# EAGLE schematic sensor_v60 (EAGLE 7.7.0)
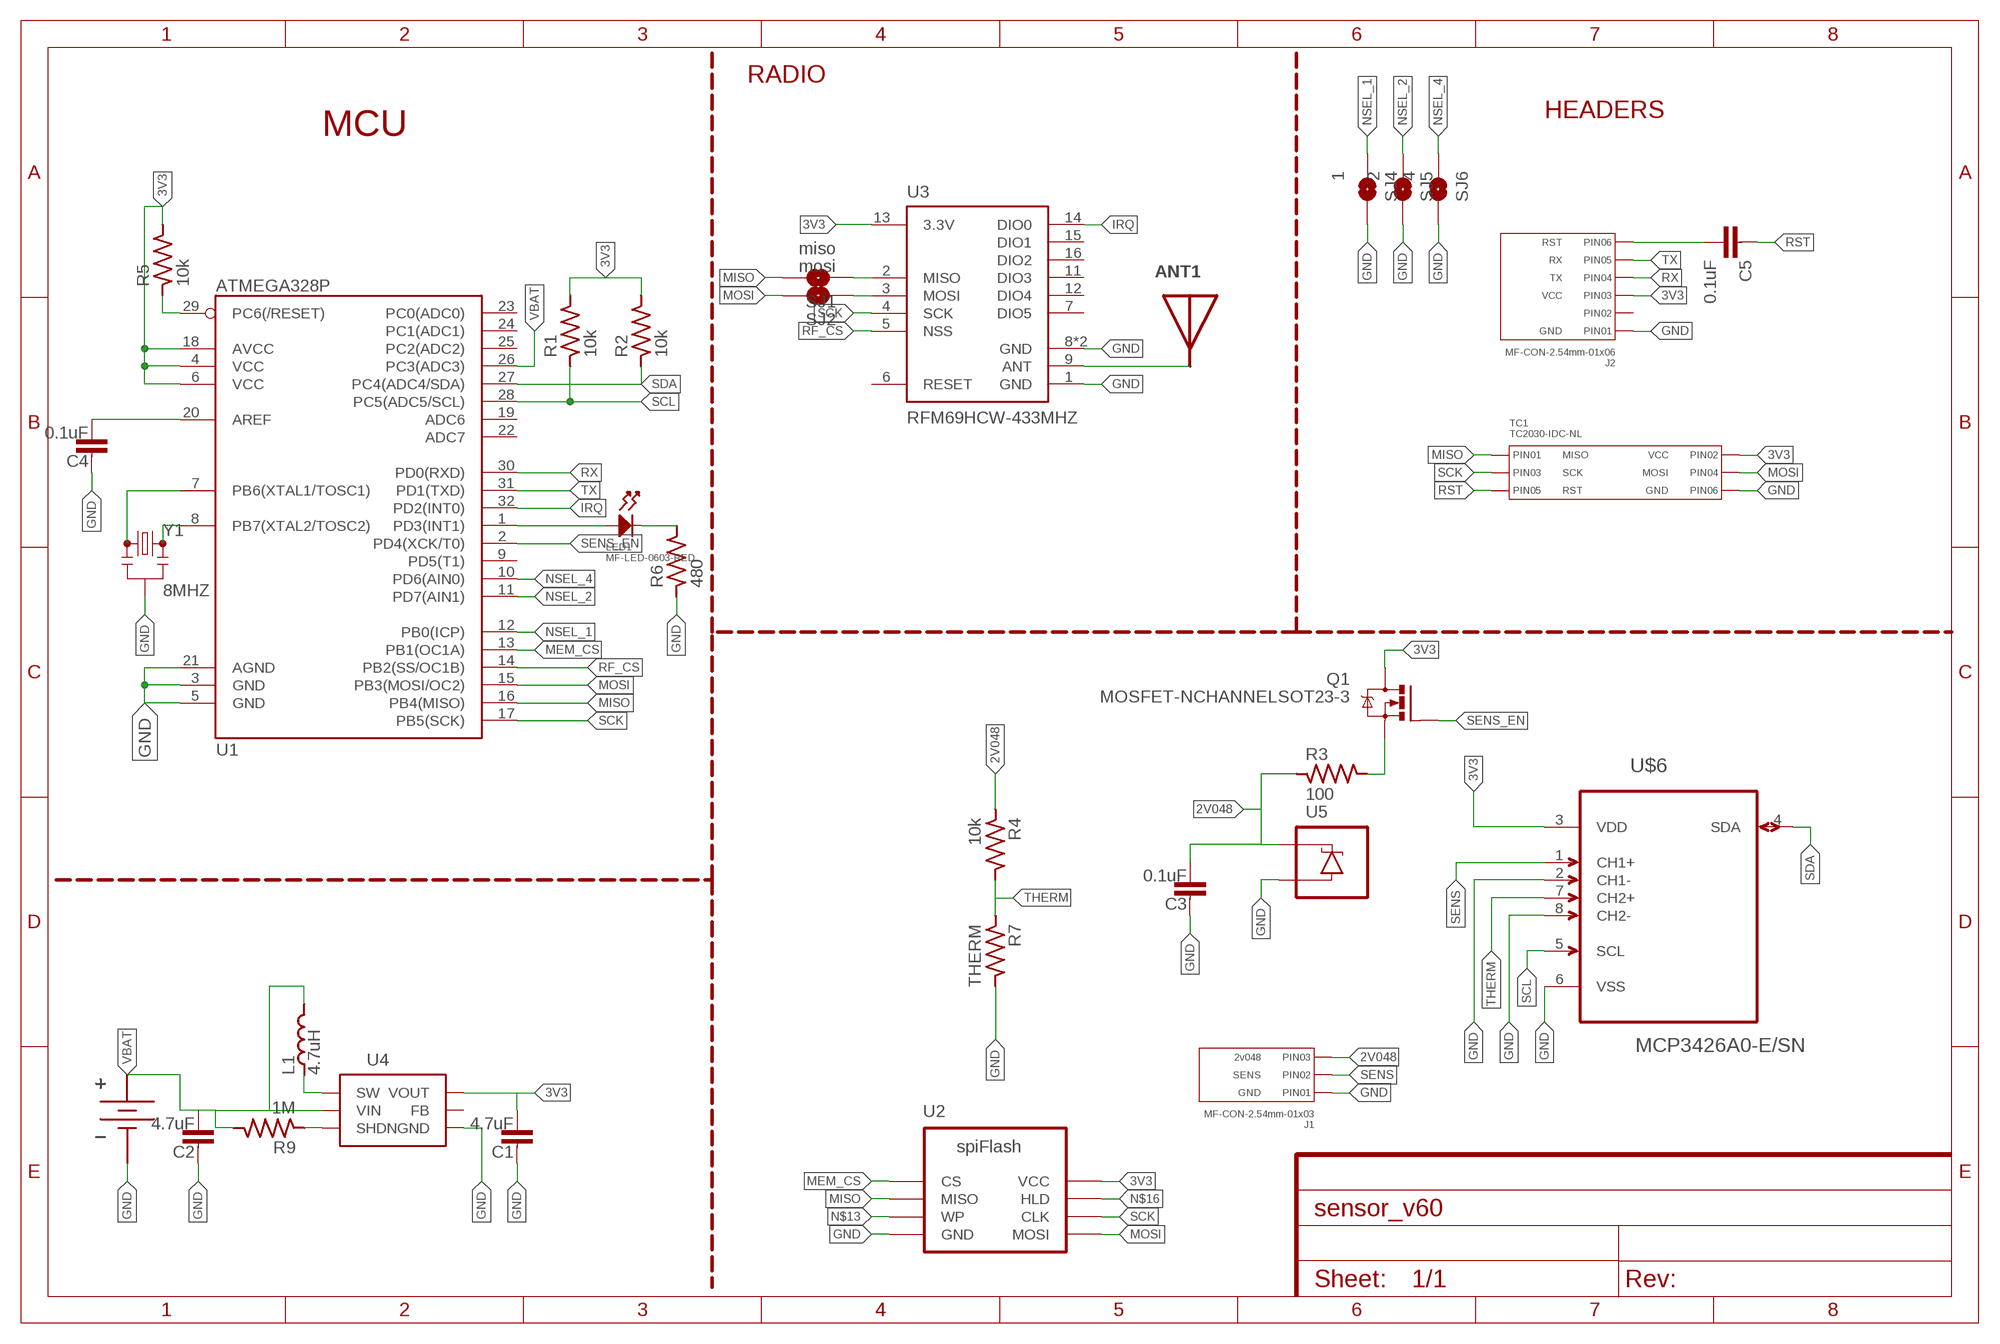
[diagram p0: schematic, sheet 1]

## Parts
ANT1  ANTENNA-433_CHIP  [ANT_433_CHIP]
C1  4.7uF  CAPACITOR_NP0603-N  [C0603-N]
C2  4.7uF  CAPACITOR_NP0603-N  [C0603-N]
C3  0.1uF  CAPACITOR_NP0603-N  [C0603-N]
C4  0.1uF  CAPACITOR_NP0603-N  [C0603-N]
C5  0.1uF  CAPACITOR0603-N  [C0603-N]
J1  MF-CON-2.54mm-01x03  CON_01X03_PTH_2.54MM  [PTH_2.54MM_01X03]
J2  MF-CON-2.54mm-01x06  CON_01X06_PTH_2.54MM  [PTH_2.54MM_01X06]
L1  4.7uH  INDUCTOR3030  [L3030]
LED1  MF-LED-0603-RED  LED_SINGLE-0603-RED  [LED0603]
Q1  MOSFET-NCHANNELSOT23-3  [SOT23-3]
R1  10k  RESISTOR0603-N  [R0603-N]
R2  10k  RESISTOR0603-N  [R0603-N]
R3  100  RESISTOR0603-N  [R0603-N]
R4  10k  RESISTOR0603-N  [R0603-N]
R5  10k  RESISTOR0603-N  [R0603-N]
R6  480  RESISTOR0603-N  [R0603-N]
R7  THERM  RESISTOR0603-N  [R0603-N]
R9  1M  RESISTOR0603-N  [R0603-N]
SJ1  miso  SOLDERJUMPERNC2  [SJ_2S-NOTRACE]
SJ2  mosi  SOLDERJUMPERNC2  [SJ_2S-NOTRACE]
SJ4  1  SOLDERJUMPERNC2  [SJ_2S-NOTRACE]
SJ5  2  SOLDERJUMPERNC2  [SJ_2S-NOTRACE]
SJ6  4  SOLDERJUMPERNC2  [SJ_2S-NOTRACE]
TC1  TC2030-IDC-NL  CON_02X03_AVRISP_TC2030-IDC-NL  [TC2030-IDC-NL]
U1  ATMEGA328P  ATMEGA328P_SMD-AU  [TQFP32]
U2  WINBOND_FLASH_4MBIT-SOIC  [SOIC8]
U3  RFM69HCW-433MHZ  [RFM69HCW-XXXS2]
U4  AAT1217-SOT23-6  [SOT23-6]
U5  LM4040-SOT-23-3  [SOT23-3]
U$1  KEYSTONEAAHOLDER_2CELL  [KEYSTONEAAHOLDER_2CELL]
U$6  MCP3426A0-E/SN  [SOIC127P600X175-8N]
Y1  8MHZ  RESONATOR8MHZ  [RESONATOR-SMD]

## Nets
2V048: C3.2 J1.P$3(PIN3) R3.1 R4.1 U5.1(C)
3V3: C1.2 J2.P$3(PIN3) Q1.3(D) R1.2 R2.2 R5.2 TC1.P$2(PIN2) U1.4(VCC) U1.6(VCC) U1.18(AVCC) U2.8(VCC) U3.13(3.3V) U4.5(VOUT) U$6.3(VDD)
GND: C1.1 C2.1 C3.1 C4.1 J1.P$1(PIN1) J2.P$1(PIN1) R6.1 R7.2 SJ4.2 SJ5.2 SJ6.2 TC1.P$6(PIN6) U1.3(GND) U1.5(GND) U1.21(AGND) U2.4(GND) U3.1(GND) U3.8(GND) U3.10(GND) U4.2(GND) U5.2(A) U$1.P$2(GND) U$6.2(CH1-) U$6.6(VSS) U$6.8(CH2-) Y1.2
IRQ: U1.32(PD2(INT0)) U3.14(DIO0)
MEM_CS: U1.13(PB1(OC1A)) U2.1(CS)
MISO: SJ1.2 TC1.P$1(PIN1) U1.16(PB4(MISO)) U2.2(MISO)
MOSI: SJ2.2 TC1.P$4(PIN4) U1.15(PB3(MOSI/OC2)) U2.5(MOSI)
N$1: R9.1 U4.4(SHDN)
N$2: ANT1.1 U3.9(ANT)
N$3: LED1.ANODE U1.1(PD3(INT1))
N$4: C4.2 U1.20(AREF)
N$5: LED1.CATHODE R6.2
N$6: L1.P$1 U4.1(SW)
N$7: U1.7(PB6(XTAL1/TOSC1)) Y1.1
N$8: U1.8(PB7(XTAL2/TOSC2)) Y1.3
N$9: SJ1.1 U3.2(MISO)
N$10: C5.2 J2.P$6(PIN6)
N$11: SJ2.1 U3.3(MOSI)
N$12: Q1.2(S) R3.2
N$13: U2.3(WP)
N$16: U2.7(HLD)
NSEL_1: SJ4.1 U1.12(PB0(ICP))
NSEL_2: SJ5.1 U1.11(PD7(AIN1))
NSEL_4: SJ6.1 U1.10(PD6(AIN0))
RF_CS: U1.14(PB2(SS/OC1B)) U3.5(NSS)
RST: C5.1 R5.1 TC1.P$5(PIN5) U1.29(PC6(/RESET))
RX: J2.P$4(PIN4) U1.30(PD0(RXD))
SCK: TC1.P$3(PIN3) U1.17(PB5(SCK)) U2.6(CLK) U3.4(SCK)
SCL: R1.1 U1.28(PC5(ADC5/SCL)) U$6.5(SCL)
SDA: R2.1 U1.27(PC4(ADC4/SDA)) U$6.4(SDA)
SENS: J1.P$2(PIN2) U$6.1(CH1+)
SENS_EN: Q1.1(G) U1.2(PD4(XCK/T0))
THERM: R4.2 R7.1 U$6.7(CH2+)
TX: J2.P$5(PIN5) U1.31(PD1(TXD))
VBAT: C2.2 L1.P$2 R9.2 U1.26(PC3(ADC3)) U4.6(VIN) U$1.P$1(VBAT)
Unconnected: J2.P$2(PIN2) U1.9(PD5(T1)) U1.19(ADC6) U1.22(ADC7) U1.23(PC0(ADC0)) U1.24(PC1(ADC1)) U1.25(PC2(ADC2)) U3.6(RESET) U3.7(DIO5) U3.11(DIO3) U3.12(DIO4) U3.15(DIO1) U3.16(DIO2) U4.3(FB)

## Notes on the sheet
- RADIO
- HEADERS
- MCU

## Library data of the parts
ANT1 = My_RF:ANTENNA; PARTNO: 0433AT62A0020E
C1-C4 = My_Passives:CAPACITOR_NP
C5 = passives-7351:CAPACITOR
J1 = My_Connectors:CON_01X03: Library: MF_Connectors Description: Header Connector with 03 Positions and 01 Rows. Use the LABEL Attribute to label the pin on the schematic and PCB. You can remove the attributes on the PCB by using the SMASH function on the part and then deleting the text.; HOUSEPART: YES; LABEL01: GND; LABEL02: SENS; LABEL03: 2v048; MPN: MF-CON-2.54mm-01x03; PARTNO: 0022053031; POPULATE: 1; URL: https://factory.macrofab.com/part/MF-CON-2.54mm-01x03
J2 = My_Connectors:CON_01X06: Library: MF_Connectors Description: Header Connector with 6 Positions and 01 Rows. Use the LABEL Attribute to label the pin on the schematic and PCB. You can remove the attributes on the PCB by using the SMASH function on the part and then deleting the text.; HOUSEPART: YES; LABEL01: GND; LABEL03: VCC; LABEL04: TX; LABEL05: RX; LABEL06: RST; MPN: MF-CON-2.54mm-01x06; POPULATE: 1; URL: https://factory.macrofab.com/part/MF-CON-2.54mm-01x06
L1 = My_Passives:INDUCTOR
LED1 = My_LEDs:LED_SINGLE: Library: MF_LEDs Description: Device for Single LED Packages. Manufacture part number (MFG#) can be added via Attributes.; HOUSEPART: YES; MPN: MF-LED-0603-RED; POPULATE: 1; URL: https://factory.macrofab.com/part/MF-LED-0603-RED
Q1 = My_Descrete_Semiconductors:MOSFET-NCHANNEL: Common NMOSFET Parts MFG P/N Store ID Prod ID FDD8780 TRANS-09984 SI7820DN TRANS-11055 FDS6630A IC-08089 2N7002PW TRANS-11151 FQP30N06L COM-10213 TRANS-10060 BSS123LT1G TRANS-08345 BSS138 TRANS-00830 BS170 2N7000
R1-R6 R9 = My_Passives:RESISTOR
R7 = My_Passives:RESISTOR; PARTNO: FIND PART!!
SJ1 SJ2 SJ4-SJ6 = My_Connectors:SOLDERJUMPER: Solder Jumper Standard SMD solder jumper. Used to automate production. Two varients : Normally Open and Normally Closed are the same, but have different paste layers. NC will have a large amount of paste and should jumper during reflow.
TC1 = My_Connectors:CON_02X03: Library: MF_Connectors Description: Header Connector with 6 Positions and 02 Rows. Use the LABEL Attribute to label the pin on the schematic and PCB. You can remove the attributes on the PCB by using the SMASH function on the part and then deleting the text.; HOUSEPART: NO; LABEL01: MISO; LABEL02: VCC; LABEL03: SCK; LABEL04: MOSI; LABEL05: RST; LABEL06: GND; MPN: TC2030-IDC-NL; PARTNO: NA; POPULATE: 0; URL: http://www.tag-connect.com/AVRISP
U1 = My_IC_Digital:ATMEGA328P_SMD: Atmel 32-pin 8-bit micro 16k flash.
U2 = My_IC_Digital:WINBOND_FLASH_4MBIT
U3 = My_RF:RFM69H; PARTNO: COM-13910; PROD_ID: IC-11997, IC-12053
U4 = My_IC_Power:AAT1217; PARTNO: AAT1217ICA-3.3-T1
U5 = My_Descrete_Semiconductors:LM4040; PARTNO: LM4040AIM3-2.0/NOPB
U$1 = _my-parts:KEYSTONEAAHOLDER_2CELL
U$6 = Microchip_By_element14_Batch_1:MCP3426A0-E/SN: Analog-to-Digital Converter; MPN: MCP3426A0-E/SN; OC_FARNELL: 1825012; OC_NEWARK: 52R9954; PACKAGE: SOIC-8; SUPPLIER: Microchip
Y1 = My_xTal:RESONATOR: Resonator Small SMD resonator. Used, eg, on the Arduino Pro/ Pro Mini boards. 8MHz- XTAL-08895 16MHz- XTAL-08900; PARTNO: CSTCE8M00G55-R0; PROD_ID: XTAL-08895